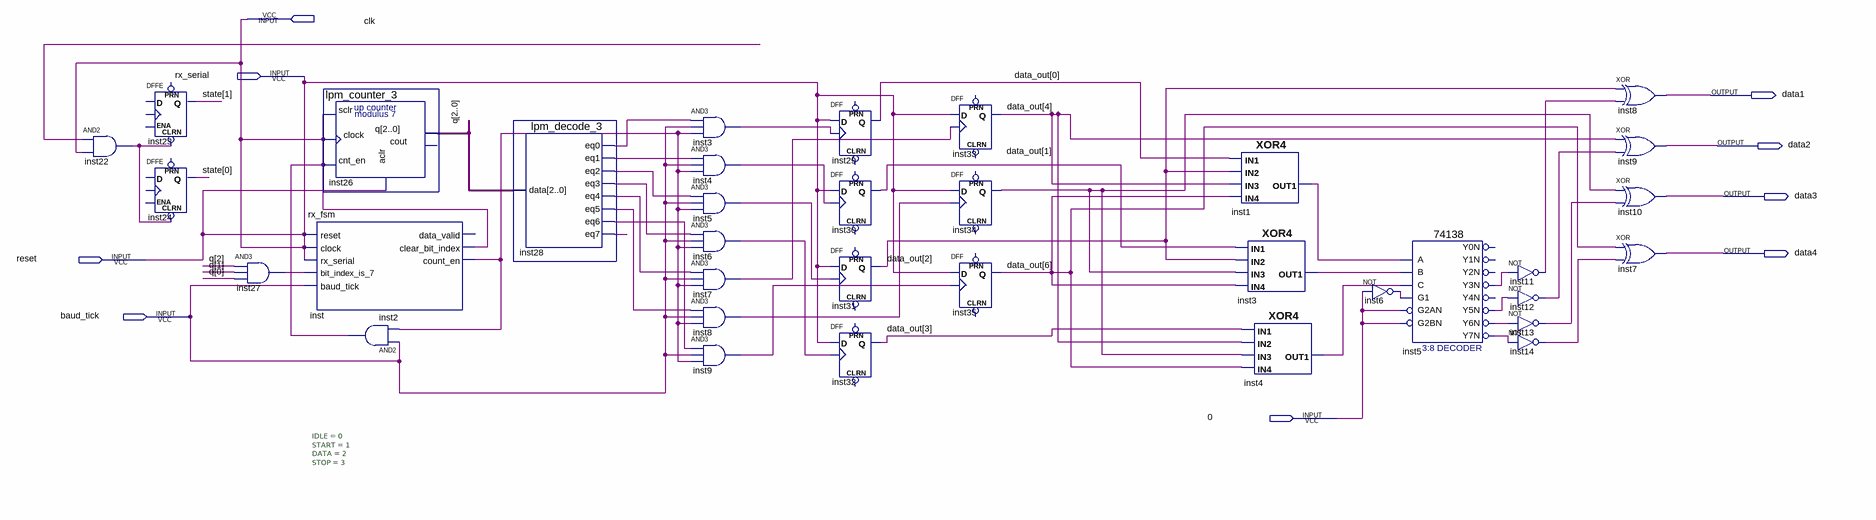
[diagram p0: schematic sheet]
// Quartus schematic rx.bdf as structural Verilog: 35 symbols, 9 pins
module rx (
  input  clk,
  input  rx_serial,
  input  reset,
  input  baud_tick,
  input  \0 ,
  output data1,
  output data2,
  output data3,
  output data4
);

  wire inst1_out1, inst3_out, inst3_out1, inst4_out, inst4_out1, inst5_out, inst5_y3n, inst5_y5n, inst5_y6n,
       inst5_y7n, inst6_out, inst6_out_2, inst7_out, inst8_out, inst9_out, inst11_out, inst12_out,
       inst13_out, inst14_out, inst22_out, inst27_out, inst28_eq0, inst28_eq1, inst28_eq2, inst28_eq3,
       inst28_eq4, inst28_eq5, inst28_eq6, inst28_eq7, inst34_q, inst_count_en, undriven;
  wire [1:0] state;
  wire [2:0] q;
  wire [6:0] data_out;

  and inst22 (inst22_out, undriven, clk);
  DFFE inst23 (.CLRN(inst22_out), .Q(state[1]));  // open: PRN, D, CLK, ENA
  DFFE inst24 (.CLRN(inst22_out), .Q(state[0]));  // open: PRN, D, CLK, ENA
  and inst27 (inst27_out, q[2], q[1], q[0]);
  lpm_counter_3 inst26 (.sclr(clk), .clock(clk), .cnt_en(clk), .aclr(clk), .q(q));  // open: cout
  rx_fsm #(.IDLE(0), .START(1), .DATA(2), .STOP(3)) inst (
    .reset(clk), .clock(clk), .rx_serial(clk), .bit_index_is_7(inst27_out), .baud_tick(baud_tick),
    .clear_bit_index(clk), .count_en(inst_count_en));  // open: data_valid
  and inst2 (clk, baud_tick, inst_count_en);
  lpm_decode_3 inst28 (
    .data(q), .eq0(inst28_eq0), .eq1(inst28_eq1), .eq2(inst28_eq2), .eq3(inst28_eq3), .eq4(inst28_eq4),
    .eq5(inst28_eq5), .eq6(inst28_eq6), .eq7(inst28_eq7));
  and inst3 (inst3_out, inst28_eq0, baud_tick, inst_count_en);
  and inst4 (inst4_out, inst28_eq1, baud_tick, inst_count_en);
  and inst5 (inst5_out, inst28_eq2, baud_tick, inst_count_en);
  and inst6 (inst6_out, inst28_eq3, baud_tick, inst_count_en);
  and inst7 (inst7_out, inst28_eq4, baud_tick, inst_count_en);
  and inst8 (inst8_out, inst28_eq5, baud_tick, inst_count_en);
  and inst9 (inst9_out, inst28_eq6, baud_tick, inst_count_en);
  DFF inst29 (.CLK(inst3_out), .D(clk), .Q(data_out[0]));  // open: CLRN, PRN
  DFF inst30 (.CLK(inst4_out), .D(clk), .Q(data_out[1]));  // open: CLRN, PRN
  DFF inst31 (.CLK(inst5_out), .D(clk), .Q(data_out[2]));  // open: CLRN, PRN
  DFF inst32 (.CLK(inst6_out), .D(clk), .Q(data_out[3]));  // open: CLRN, PRN
  DFF inst33 (.CLK(inst7_out), .D(clk), .Q(data_out[4]));  // open: CLRN, PRN
  DFF inst34 (.CLK(inst8_out), .D(clk), .Q(inst34_q));  // open: CLRN, PRN
  DFF inst35 (.CLK(inst9_out), .D(clk), .Q(data_out[6]));  // open: CLRN, PRN
  XOR4 inst1 (.IN3(data_out[4]), .IN4(data_out[6]), .IN2(data_out[2]), .IN1(data_out[0]), .OUT1(inst1_out1));
  XOR4 inst3_dup2 (.IN3(inst34_q), .IN4(data_out[6]), .IN2(data_out[2]), .IN1(data_out[1]), .OUT1(inst3_out1));
  XOR4 inst4_dup2 (.IN3(inst34_q), .IN4(data_out[6]), .IN2(data_out[4]), .IN1(data_out[3]), .OUT1(inst4_out1));
  \74138  inst5_dup2 (
    .A(inst1_out1), .B(inst3_out1), .G1(inst6_out_2), .C(inst4_out1), .G2AN(\0 ), .G2BN(\0 ),
    .Y3N(inst5_y3n), .Y5N(inst5_y5n), .Y6N(inst5_y6n), .Y7N(inst5_y7n));  // open: Y0N, Y1N, Y2N, Y4N
  not inst6_dup2 (inst6_out_2, \0 );
  not inst11 (inst11_out, inst5_y3n);
  not inst12 (inst12_out, inst5_y5n);
  not inst13 (inst13_out, inst5_y6n);
  not inst14 (inst14_out, inst5_y7n);
  xor inst8_dup2 (data1, data_out[2], inst11_out);
  xor inst9_dup2 (data2, data_out[4], inst12_out);
  xor inst10 (data3, inst34_q, inst13_out);
  xor inst7_dup2 (data4, data_out[6], inst14_out);

  assign reset = clk;
  assign rx_serial = clk;
endmodule
